# Altium schematic sheet MBoard1-R1.0.SchDoc: HLib - MBoard1
size A; DrawnBy: MBoard team; DocumentNumber: 1; Revision: 1.1; SheetNumber: 1; SheetTotal: 7; ProjectName: HLib
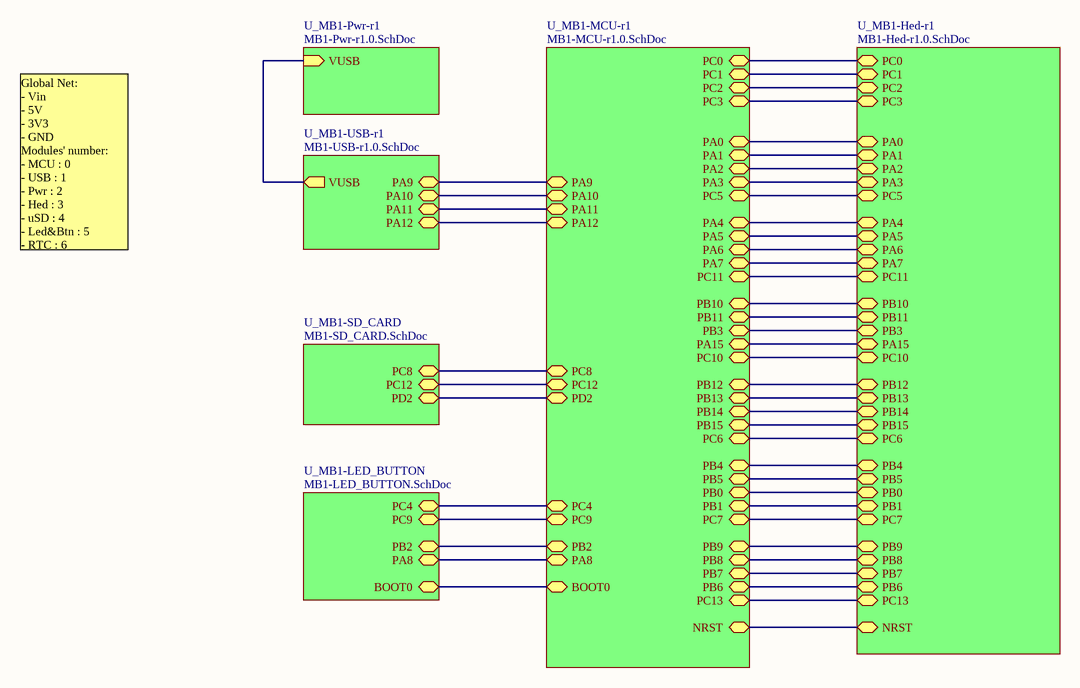
[diagram p0: MBoard1-R1.0.SchDoc]

## Sub-sheets
U_MB1-Hed-r1 = MB1-Hed-r1.0.SchDoc: PC0 (bidir), PC1 (bidir), PC2 (bidir), PC3 (bidir), PA0 (bidir), PA1 (bidir), PA2 (bidir), PA3 (bidir), PA4 (bidir), PA5 (bidir), PA6 (bidir), PA7 (bidir), PB10 (bidir), PB11 (bidir), PB3 (bidir), PA15 (bidir), PB12 (bidir), PB13 (bidir), PB14 (bidir), PB15 (bidir), PB4 (bidir), PB5 (bidir), PB0 (bidir), PB1 (bidir), PB9 (bidir), PB8 (bidir), PB6 (bidir), PB7 (bidir), NRST (bidir), PC6 (bidir), PC10 (bidir), PC5, PC11, PC7 (bidir), PC13 (bidir)
U_MB1-LED_BUTTON = MB1-LED_BUTTON.SchDoc: PC4 (bidir), PB2 (bidir), PA8 (bidir), BOOT0 (bidir), PC9 (bidir)
U_MB1-MCU-r1 = MB1-MCU-r1.0.SchDoc: PA0 (bidir), PA1 (bidir), PA2 (bidir), PA3 (bidir), PA4 (bidir), PA5 (bidir), PA6 (bidir), PA7 (bidir), PA8 (bidir), PA9 (bidir), PA10 (bidir), PA11 (bidir), PA12 (bidir), PA15 (bidir), PD2 (bidir), BOOT0 (bidir), NRST (bidir), PB0 (bidir), PB1 (bidir), PB2 (bidir), PB3 (bidir), PB4 (bidir), PB5 (bidir), PB6 (bidir), PB7 (bidir), PB8 (bidir), PB9 (bidir), PB10 (bidir), PB11 (bidir), PB12 (bidir), PB13 (bidir), PB14 (bidir), PB15 (bidir), PC0 (bidir), PC1 (bidir), PC2 (bidir), PC3 (bidir), PC4 (bidir), PC5 (bidir), PC6 (bidir), PC7 (bidir), PC8 (bidir), PC9 (bidir), PC10 (bidir), PC11 (bidir), PC12 (bidir), PC13 (bidir)
U_MB1-Pwr-r1 = MB1-Pwr-r1.0.SchDoc: VUSB (in)
U_MB1-SD_CARD = MB1-SD_CARD.SchDoc: PD2 (bidir), PC12 (bidir), PC8 (bidir)
U_MB1-USB-r1 = MB1-USB-r1.0.SchDoc: PA9 (bidir), PA10 (bidir), VUSB (out), PA11 (bidir), PA12 (bidir)

## Nets
(unnamed): sheet U_MB1-Pwr-r1/VUSB, sheet U_MB1-USB-r1/VUSB
(unnamed): sheet U_MB1-USB-r1/PA9, sheet U_MB1-MCU-r1/PA9
(unnamed): sheet U_MB1-USB-r1/PA10, sheet U_MB1-MCU-r1/PA10
(unnamed): sheet U_MB1-USB-r1/PA11, sheet U_MB1-MCU-r1/PA11
(unnamed): sheet U_MB1-USB-r1/PA12, sheet U_MB1-MCU-r1/PA12
(unnamed): sheet U_MB1-Hed-r1/PC0, sheet U_MB1-MCU-r1/PC0
(unnamed): sheet U_MB1-Hed-r1/PC1, sheet U_MB1-MCU-r1/PC1
(unnamed): sheet U_MB1-Hed-r1/PC2, sheet U_MB1-MCU-r1/PC2
(unnamed): sheet U_MB1-Hed-r1/PC3, sheet U_MB1-MCU-r1/PC3
(unnamed): sheet U_MB1-Hed-r1/PA0, sheet U_MB1-MCU-r1/PA0
(unnamed): sheet U_MB1-Hed-r1/PA1, sheet U_MB1-MCU-r1/PA1
(unnamed): sheet U_MB1-Hed-r1/PA2, sheet U_MB1-MCU-r1/PA2
(unnamed): sheet U_MB1-Hed-r1/PA3, sheet U_MB1-MCU-r1/PA3
(unnamed): sheet U_MB1-Hed-r1/PA4, sheet U_MB1-MCU-r1/PA4
(unnamed): sheet U_MB1-Hed-r1/PA5, sheet U_MB1-MCU-r1/PA5
(unnamed): sheet U_MB1-Hed-r1/PA6, sheet U_MB1-MCU-r1/PA6
(unnamed): sheet U_MB1-Hed-r1/PA7, sheet U_MB1-MCU-r1/PA7
(unnamed): sheet U_MB1-Hed-r1/PB10, sheet U_MB1-MCU-r1/PB10
(unnamed): sheet U_MB1-Hed-r1/PB11, sheet U_MB1-MCU-r1/PB11
(unnamed): sheet U_MB1-Hed-r1/PB3, sheet U_MB1-MCU-r1/PB3
(unnamed): sheet U_MB1-Hed-r1/PA15, sheet U_MB1-MCU-r1/PA15
(unnamed): sheet U_MB1-Hed-r1/PB12, sheet U_MB1-MCU-r1/PB12
(unnamed): sheet U_MB1-Hed-r1/PB13, sheet U_MB1-MCU-r1/PB13
(unnamed): sheet U_MB1-Hed-r1/PB14, sheet U_MB1-MCU-r1/PB14
(unnamed): sheet U_MB1-Hed-r1/PB15, sheet U_MB1-MCU-r1/PB15
(unnamed): sheet U_MB1-Hed-r1/PB4, sheet U_MB1-MCU-r1/PB4
(unnamed): sheet U_MB1-Hed-r1/PB5, sheet U_MB1-MCU-r1/PB5
(unnamed): sheet U_MB1-Hed-r1/PB0, sheet U_MB1-MCU-r1/PB0
(unnamed): sheet U_MB1-Hed-r1/PB1, sheet U_MB1-MCU-r1/PB1
(unnamed): sheet U_MB1-Hed-r1/PB9, sheet U_MB1-MCU-r1/PB9
(unnamed): sheet U_MB1-Hed-r1/PB8, sheet U_MB1-MCU-r1/PB8
(unnamed): sheet U_MB1-Hed-r1/PB6, sheet U_MB1-MCU-r1/PB6
(unnamed): sheet U_MB1-Hed-r1/PB7, sheet U_MB1-MCU-r1/PB7
(unnamed): sheet U_MB1-Hed-r1/NRST, sheet U_MB1-MCU-r1/NRST
(unnamed): sheet U_MB1-Hed-r1/PC6, sheet U_MB1-MCU-r1/PC6
(unnamed): sheet U_MB1-Hed-r1/PC10, sheet U_MB1-MCU-r1/PC10
(unnamed): sheet U_MB1-Hed-r1/PC5, sheet U_MB1-MCU-r1/PC5
(unnamed): sheet U_MB1-Hed-r1/PC11, sheet U_MB1-MCU-r1/PC11
(unnamed): sheet U_MB1-Hed-r1/PC7, sheet U_MB1-MCU-r1/PC7
(unnamed): sheet U_MB1-Hed-r1/PC13, sheet U_MB1-MCU-r1/PC13
(unnamed): sheet U_MB1-MCU-r1/PA8, sheet U_MB1-LED_BUTTON/PA8
(unnamed): sheet U_MB1-MCU-r1/PD2, sheet U_MB1-SD_CARD/PD2
(unnamed): sheet U_MB1-MCU-r1/BOOT0, sheet U_MB1-LED_BUTTON/BOOT0
(unnamed): sheet U_MB1-MCU-r1/PB2, sheet U_MB1-LED_BUTTON/PB2
(unnamed): sheet U_MB1-MCU-r1/PC4, sheet U_MB1-LED_BUTTON/PC4
(unnamed): sheet U_MB1-MCU-r1/PC8, sheet U_MB1-SD_CARD/PC8
(unnamed): sheet U_MB1-MCU-r1/PC9, sheet U_MB1-LED_BUTTON/PC9
(unnamed): sheet U_MB1-MCU-r1/PC12, sheet U_MB1-SD_CARD/PC12

## Notes on the sheet
- Global Net:
  - Vin
  - 5V
  - 3V3
  - GND
  Modules' number:
  - MCU : 0
  - USB : 1
  - Pwr : 2
  - Hed : 3
  - uSD : 4
  - Led&Btn : 5
  - RTC : 6